# EAGLE design Freqy Lights 1v1 (EAGLE 7.3.0)
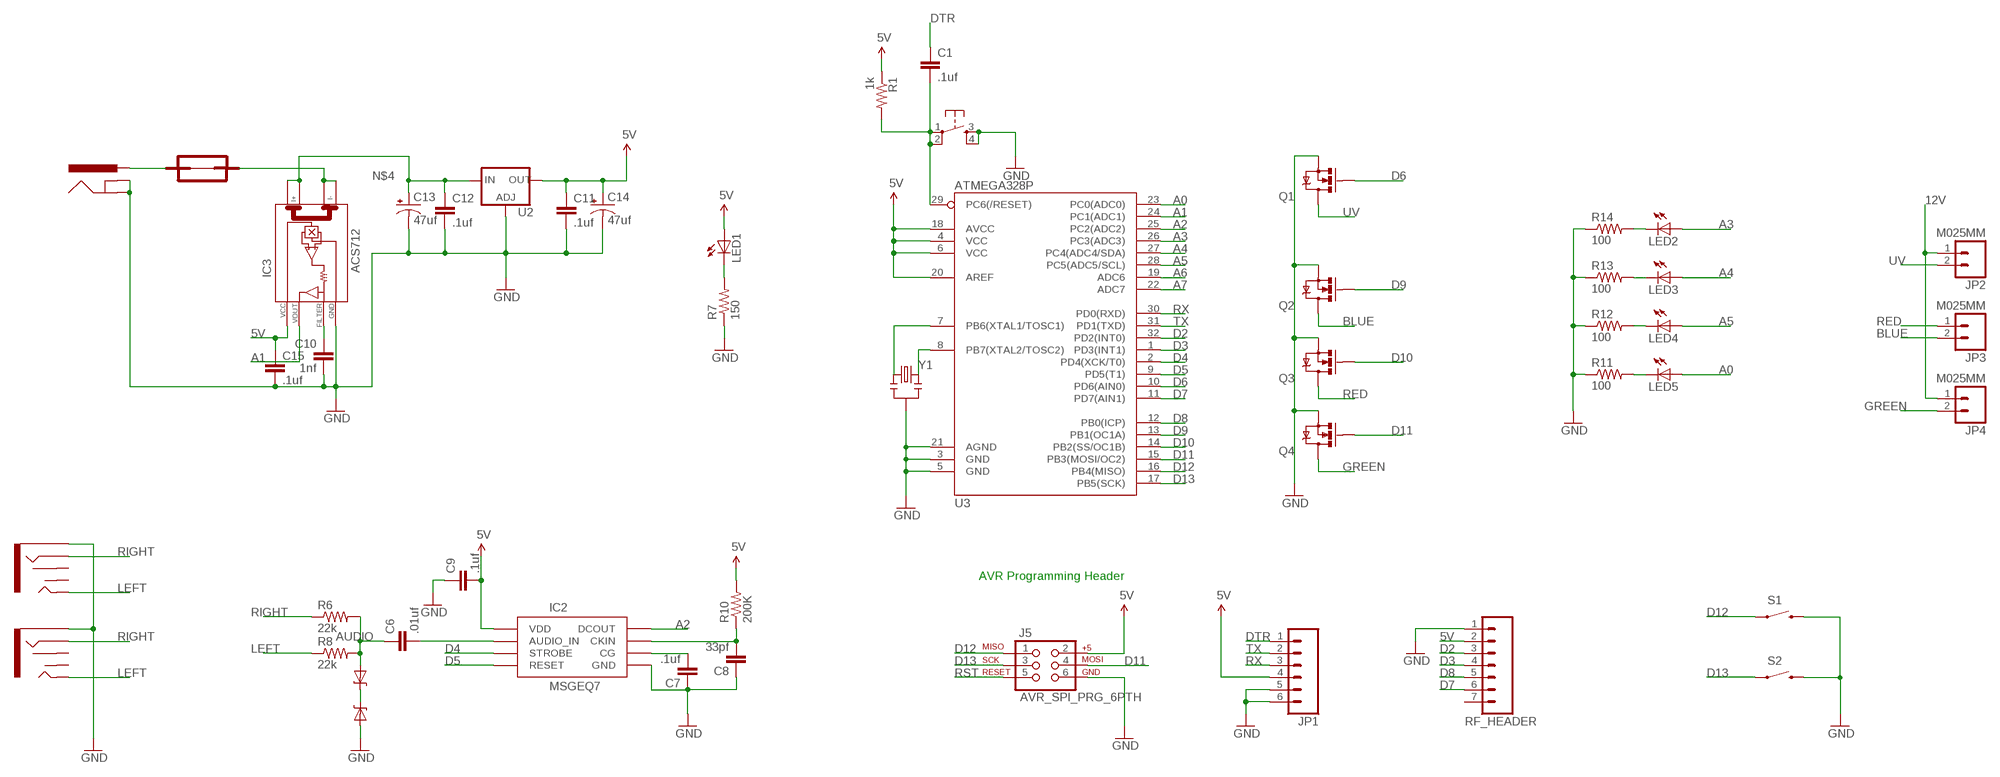
[diagram p0: schematic, sheet 1]

## Parts
AJ1  SC1488-1-ND_SMD_AUDIO_3.5  [3.5MM_SMD_AUDIO_SC1488-1-ND]
AJ2  SC1488-1-ND_SMD_AUDIO_3.5  [3.5MM_SMD_AUDIO_SC1488-1-ND]
BJ1  CP-202BH-ND_POWERJACK  [POWER_JACK_CP-202BH-ND]
C1  .1uf  CAP1206  [1206]
C6  .01uf  CAP1206  [1206]
C7  .1uf  CAP1206  [1206]
C8  33pf  CAP1206  [1206]
C9  .1uf  CAP1206  [1206]
C10  1nf  CAP1206  [1206]
C11  .1uf  CAP1206  [1206]
C12  .1uf  CAP1206  [1206]
C13  47uf  493-2202-1-ND_SMD_CAP  [SMD_47UF_CAP_493-2202-1-ND]
C14  47uf  493-2202-1-ND_SMD_CAP  [SMD_47UF_CAP_493-2202-1-ND]
C15  .1uf  CAP1206  [1206]
F1  SSQ12  [SSQ12]
IC2  MSGEQ7SOIC  [SOIC8]
IC3  ACS712  [SO08]
J5  AVR_SPI_PRG_6PTH  [2X3]
JP1  M06SIP  [1X06]
JP2  M025MM  [SCREWTERMINAL-5MM-2]
JP3  M025MM  [SCREWTERMINAL-5MM-2]
JP4  M025MM  [SCREWTERMINAL-5MM-2]
LED1  LED1206  [LED-1206]
LED2  LED1206  [LED-1206]
LED3  LED1206  [LED-1206]
LED4  LED1206  [LED-1206]
LED5  LED1206  [LED-1206]
P1  CKN9085CT-ND_SMT_PUSHBUTTON  [SMT_PUSHBUTTON_CKN9085CT-ND]
Q1  MOSFET-NCHANNELBSS138  [SOT23]
Q2  MOSFET-NCHANNELBSS138  [SOT23]
Q3  MOSFET-NCHANNELBSS138  [SOT23]
Q4  MOSFET-NCHANNELBSS138  [SOT23]
R1  1k  RESISTOR1206  [1206]
R6  22k  RESISTOR1206  [1206]
R7  150  RESISTOR1206  [1206]
R8  22k  RESISTOR1206  [1206]
R10  200K  RESISTOR1206  [1206]
R11  100  RESISTOR1206  [1206]
R12  100  RESISTOR1206  [1206]
R13  100  RESISTOR1206  [1206]
R14  100  RESISTOR1206  [1206]
RF_HEADER  M07  [1X07]
S1  SWITCH-MOMENTARY-2PTH  [TACTILE-PTH]
S2  SWITCH-MOMENTARY-2PTH  [TACTILE-PTH]
U2  V_REG_317SMD  [SOT223]
U3  ATMEGA328P  ATMEGA328_SMT  [TQFP32-08]
U$10  MM3Z3V3ST1GOSCT-ND_3V_DIODE  [3V_DIODE_MM3Z3V3ST1GOSCT-ND]
U$11  MM3Z3V3ST1GOSCT-ND_3V_DIODE  [3V_DIODE_MM3Z3V3ST1GOSCT-ND]
Y1  RESONATORPTH  [RESONATOR-PTH]

## Nets
5V: C9.2 C11.1 C14.P$2(+) C15.1 IC2.1(VDD) IC3.8(VCC) J5.2 JP1.4 LED1.A R1.1 R10.2 RF_HEADER.2 U2.2(OUT) U3.4(VCC) U3.6(VCC) U3.18(AVCC) U3.20(AREF)
12V: C12.1 C13.P$2(+) IC3.1(I+_0) IC3.2(I+_1) JP2.1 JP4.1 U2.3(IN)
A0: LED5.A U3.23(PC0(ADC0))
A1: IC3.7(VOUT) U3.24(PC1(ADC1))
A2: IC2.3(DCOUT) U3.25(PC2(ADC2))
A3: LED2.A U3.26(PC3(ADC3))
A4: LED3.A U3.27(PC4(ADC4/SDA))
A5: LED4.A U3.28(PC5(ADC5/SCL))
A6: U3.19(ADC6)
A7: U3.22(ADC7)
AUDIO: C6.1 R6.2 R8.2 U$11.P$2(A)
BLUE: JP3.2 Q2.3(D)
D2: RF_HEADER.3 U3.32(PD2(INT0))
D3: RF_HEADER.4 U3.1(PD3(INT1))
D4: IC2.4(STROBE) U3.2(PD4(XCK/T0))
D5: IC2.7(RESET) U3.9(PD5(T1))
D6: Q1.1(G) U3.10(PD6(AIN0))
D7: RF_HEADER.6 U3.11(PD7(AIN1))
D8: RF_HEADER.5 U3.12(PB0(ICP))
D9: Q2.1(G) U3.13(PB1(OC1A))
D10: Q3.1(G) U3.14(PB2(SS/OC1B))
D11: J5.4 Q4.1(G) U3.15(PB3(MOSI/OC2))
D12: J5.1 S1.1 U3.16(PB4(MISO))
D13: J5.3 S2.1 U3.17(PB5(SCK))
DTR: C1.1 JP1.1
GND: AJ1.RING AJ2.RING BJ1.GND BJ1.GNDBRK(GNDBREAK) C7.1 C8.1 C9.1 C10.2 C11.2 C12.2 C13.P$1(-) C14.P$1(-) C15.2 IC2.2(GND) IC3.5(GND) J5.6 JP1.5 JP1.6 P1.3 P1.4 Q1.2(S) Q2.2(S) Q3.2(S) Q4.2(S) R7.1 R11.1 R12.1 R13.1 R14.1 RF_HEADER.1 S1.3 S2.3 U2.1(ADJ) U3.3(GND) U3.5(GND) U3.21(AGND) U$10.P$2(A) Y1.2
GREEN: JP4.2 Q4.3(D)
LEFT: AJ1.TIP AJ2.TIP R8.1
N$3: U$10.P$1(C) U$11.P$1(C)
N$4: F1.P$2 IC3.3(I-_0) IC3.4(I-_1)
N$6: C7.2 IC2.6(CG)
N$9: C6.2 IC2.5(AUDIO_IN)
N$10: LED1.C R7.2
N$11: C8.2 IC2.8(CKIN) R10.1
N$13: U3.7(PB6(XTAL1/TOSC1)) Y1.1
N$14: U3.8(PB7(XTAL2/TOSC2)) Y1.3
N$15: C10.1 IC3.6(FILTER)
N$16: LED5.C R11.2
N$17: LED4.C R12.2
N$18: LED3.C R13.2
N$19: LED2.C R14.2
N$22: BJ1.PWR F1.P$1
RED: JP3.1 Q3.3(D)
RIGHT: AJ1.SLEEVE AJ2.SLEEVE R6.1
RST: C1.2 J5.5 P1.1 P1.2 R1.2 U3.29(PC6(/RESET))
RX: JP1.3 U3.30(PD0(RXD))
TX: JP1.2 U3.31(PD1(TXD))
UV: JP2.2 Q1.3(D)
Unconnected: AJ1.RSH AJ1.TSH AJ2.RSH AJ2.TSH RF_HEADER.7

## Notes on the sheet
- AVR Programming Header

## Library data of the parts
AJ1 AJ2 = SAUVE:SC1488-1-ND_SMD_AUDIO_3.5
BJ1 = SAUVE:CP-202BH-ND_POWERJACK
C1 C6-C12 C15 = SparkFun-Capacitors:CAP: Capacitor Standard 0603 ceramic capacitor, and 0.1" leaded capacitor.
C13 C14 = SAUVE:493-2202-1-ND_SMD_CAP
F1 = SAUVE:SSQ12
IC2 = SparkFun-AnalogIC:MSGEQ7: 7-band graphic equalizer
IC3 = ACS712:ACS712
J5 = SparkFun-Connectors:AVR_SPI_PRG_6: AVR ISP 6 Pin This is the reduced ISP connector for AVR programming. Common on Arduino. This footprint will take up less PCB space and can be used with a 10-pin to 6-pin adapter such as SKU: BOB-08508
JP1 = SparkFun-Connectors:M06: Header 6 Standard 6-pin 0.1" header. Use with straight break away headers (SKU : PRT-00116), right angle break away headers (PRT-00553), swiss pins (PRT-00743), machine pins (PRT-00117), and female headers (PRT-00115). Molex polarized connector foot print use with SKU : PRT-08094 with associated crimp pins and housings. NOTES ON THE VARIANTS LOCK and LOCK_LONGPADS... This footprint was designed to help hold the alignment of a through-hole component (i.e. 6-pin header) while soldering it into place. You may notice that each hole has been shifted either up or down by 0.005 of an inch from it's more standard position (which is a perfectly straight line). This slight alteration caused the pins (the squares in the middle) to touch the edges of the holes. Because they are alternating, it causes a "brace" to hold the component in place. 0.005 has proven to be the perfect amount of "off-center" position when using our standard breakaway headers. Although looks a little odd when you look at the bare footprint, once you have a header in there, the alteration is very hard to notice. Also,if you push a header all the way into place, it is covered up entirely on the bottom side. This idea of altering the position of holes to aid alignment will be further integrated into the Sparkfun Library for other footprints. It can help hold any component with 3 or more connection pins.
JP2-JP4 = SparkFun-Connectors:M02: Standard 2-pin 0.1" header. Use with - straight break away headers ( PRT-00116) - right angle break away headers (PRT-00553) - swiss pins (PRT-00743) - machine pins (PRT-00117) - female headers (PRT-00115) Molex polarized connector foot print use with: PRT-08233 with associated crimp pins and housings. 2.54_SCREWTERM for use with PRT-10571. 3.5mm Screw Terminal footprints for PRT-08084 5mm Screw Terminal footprints for use with PRT-08433
LED1-LED5 = SparkFun-LED:LED: LEDs Standard schematic elements and footprints for 5mm, 3mm, 1206, and 0603 sized LEDs. 5mm - Spark Fun Electronics SKU : COM-00529 (and others)
P1 = SAUVE:CKN9085CT-ND_SMT_PUSHBUTTON
Q1-Q4 = SparkFun-DiscreteSemi:MOSFET-NCHANNEL: Common NMOSFET Parts MFG P/N Store ID Prod ID FDD8780 TRANS-09984 SI7820DN TRANS-11055 FDS6630A IC-08089 2N7002PW TRANS-11151 FQP30N06L COM-10213 TRANS-10060 BSS123LT1G TRANS-08345 BSS138 TRANS-00830 BS170 2N7000; PROD_ID: TRANS-00830
R1 R6-R8 R10-R14 = SparkFun-Resistors:RESISTOR: Resistor Basic schematic elements and footprints for 0603, 1206, and PTH resistors.
RF_HEADER = SparkFun-Connectors:M07: Header 7 Standard 7-pin 0.1" header. Use with straight break away headers (SKU : PRT-00116), right angle break away headers (PRT-00553), swiss pins (PRT-00743), machine pins (PRT-00117), and female headers (PRT-00115). NOTES ON THE VARIANTS LOCK and LOCK_LONGPADS... This footprint was designed to help hold the alignment of a through-hole component (i.e. 7-pin header) while soldering it into place. You may notice that each hole has been shifted either up or down by 0.005 of an inch from it's more standard position (which is usually a perfectly straight line). This slight alteration caused the pins (the squares in the middle) to touch the edges of the holes. Because they are alternating, it causes a "brace" to hold the header in place. 0.005 has proven to be the perfect amount of "off-center" position when using our standard breakaway headers. Although looks a little odd when you look at the bare footprint, once you have a header in there, the alteration is very hard to notice. Also, if you push a header all the way into place, it is covered up entirely on the bottom side. This idea of altering the position of holes to aid alignment will be further integrated into the Sparkfun Library for other footprints. It can help hold any component with 3 or more connection pins.
S1 S2 = SparkFun-Electromechanical:SWITCH-MOMENTARY-2: Various NO switches- pushbuttons, reed, etc
U2 = SparkFun-PowerIC:V_REG_317: Voltage Regulator Standard LM317 adjustable voltage regulator. AOI (Adjust Output Input). Google 'LM317 Calculator' for easy to use app to get the two resistor values needed. 240/720 for 5V output. 240/390 for 3.3V output. Spark Fun Electronics SKU : COM-00527
U3 = SparkFun-DigitalIC:ATMEGA328_SMT: 32-Pin Atmega328 part Commonly used on Arduino compatible boards Available in QFP and QFN packages TQFP is IC-09069 QFN is non-stock; PROD_ID: IC-09069
U$10 U$11 = SAUVE:MM3Z3V3ST1GOSCT-ND_3V_DIODE
Y1 = SparkFun-FreqCtrl:RESONATOR: Resonator Small SMD resonator. Used, eg, on the Arduino Pro/ Pro Mini boards. 8MHz- XTAL-08895 16MHz- XTAL-08900

## Board
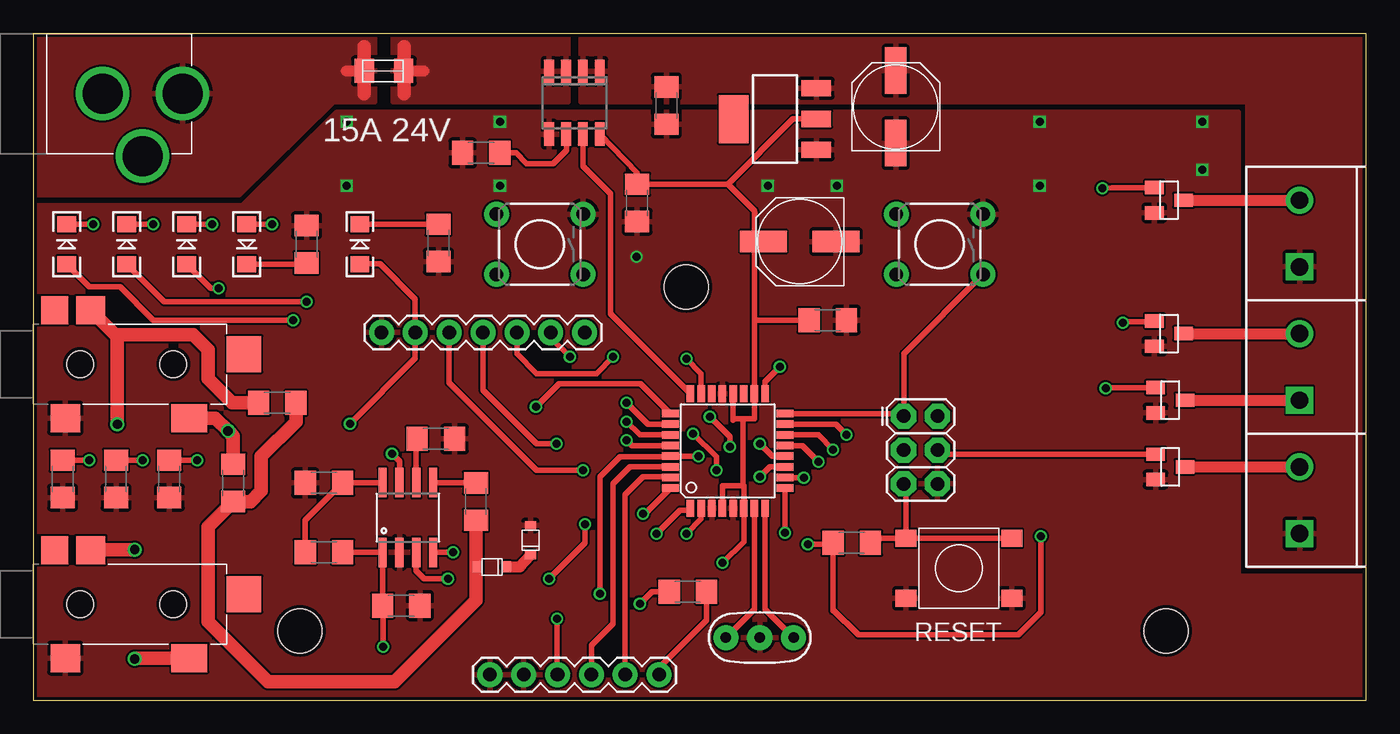
[diagram p1: board, top side]
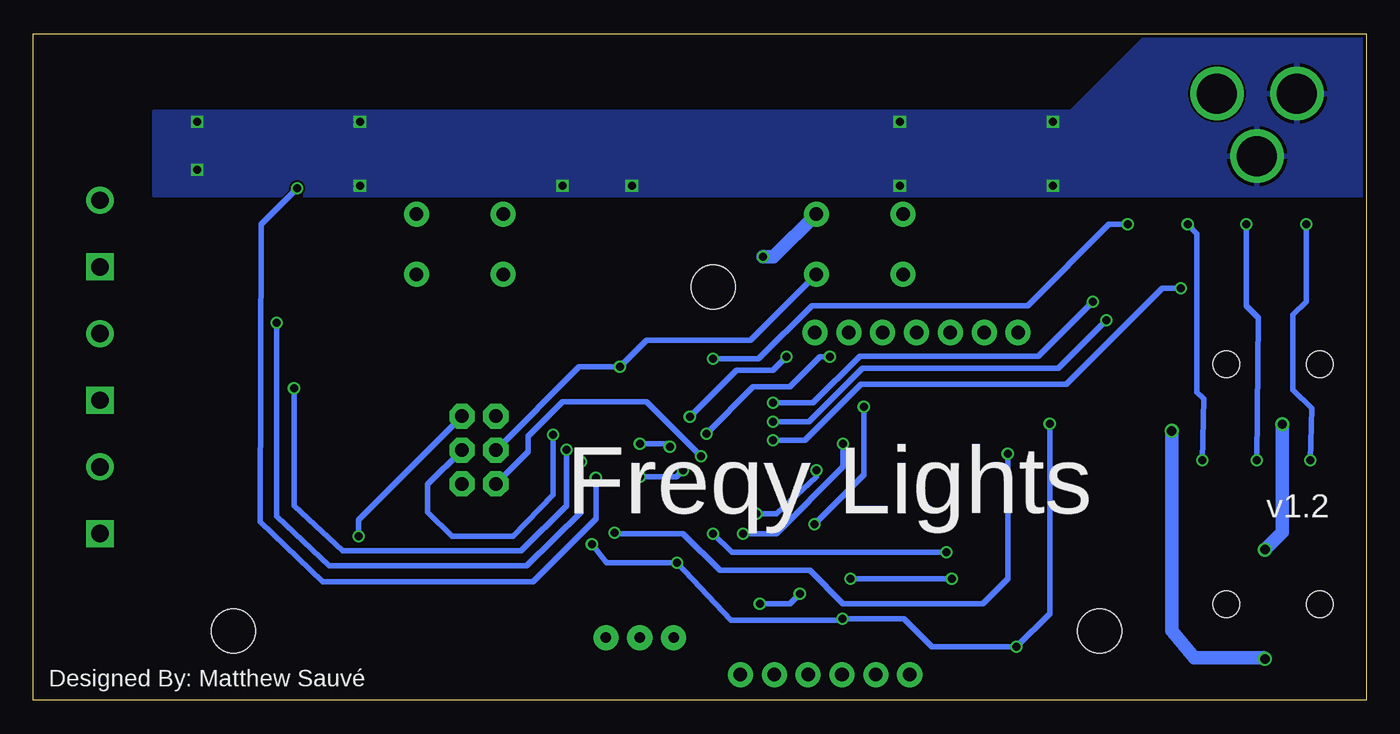
[diagram p2: board, bottom side, seen from below]

Size 100 x 50 mm. Coordinates in mm from the lower left corner, seen from the top.
Outline: 0,0 100,0 100,50 0,50 0,0
Copper layers (1*16): Top 0.035mm / dielectric 1.5mm / Bottom 0.035mm
Design rules "ITEADstudio_2-layer_DRC": minimum track width 6mil, minimum drill 12mil, track to track 6mil, track to pad 6mil, pad to pad 6mil, via to via 6mil, smd to smd 0mil, copper to edge 10mil, drill to drill 10mil, minimum pad ring 10mil, minimum via ring 6mil, stop-mask expansion 2mil, vias tented up to drill 100mil, thermal gap 10mil

### Footprints (pad centres in the part's own frame; a part is rotated, then mirrored left to right if it is on the bottom)
3.5MM_SMD_AUDIO_SC1488-1-ND = smd 2.2 x 2.1: RING 2.4,-4.05; SLEEVE 4.3,4.05 | smd 2 x 2.1: RSH 1.6,4.05 | smd 2.7 x 2.1: TIP 11.7,-4.05 | smd 2.6 x 2.7: TSH 15.8,0.75 | hole 2: 3.5,0; 10.5,0
POWER_JACK_CP-202BH-ND = drill 3: GND -3,0; GNDBRK 0,-4.7; PWR 3,0
1206 = smd 1.6 x 1.8: 1 -1.4,0; 2 1.4,0
SMD_47UF_CAP_493-2202-1-ND = smd 1.6 x 3.5: P$1 0,-2.72; P$2 0,2.72
SSQ12 = smd 1.45 x 1.8: P$1 -1.475,0; P$2 1.475,0
SOIC8 = smd 0.61 x 2.21: 1 -1.905,-2.616; 2 -0.635,-2.616; 3 0.635,-2.616; 4 1.905,-2.616; 5 1.905,2.616; 6 0.635,2.616; 7 -0.635,2.616; 8 -1.905,2.616
SO08 = smd 0.72 x 1.78: 1 -1.905,-2.35; 2 -0.635,-2.35; 3 0.635,-2.35; 4 1.905,-2.35; 5 1.905,2.35; 6 0.635,2.35; 7 -0.635,2.35; 8 -1.905,2.35
2X3 = drill 1.016 pad 1.88 octagon: 1 0,0; 2 0,2.54; 3 2.54,0; 4 2.54,2.54; 5 5.08,0; 6 5.08,2.54
1X06 = drill 1.016 pad 1.88: 1 0,0; 2 2.54,0; 3 5.08,0; 4 7.62,0; 5 10.16,0; 6 12.7,0
SCREWTERMINAL-5MM-2 = drill 1.3 pad 2.032 square: 1 0,0 | drill 1.3 pad 2.032: 2 5,0
LED-1206 = smd 1.2 x 1.4: A -1.5,0; C 1.5,0
SMT_PUSHBUTTON_CKN9085CT-ND = smd 1.55 x 1.3: 1 -3.975,2.25; 2 3.975,2.25; 3 -3.975,-2.25; 4 3.975,-2.25
SOT23 = smd 1 x 1.4: 1 -0.95,-1.1; 2 0.95,-1.1; 3 0,1.1
1X07 = drill 1.016 pad 1.88: 1 0,0; 2 2.54,0; 3 5.08,0; 4 7.62,0; 5 10.16,0; 6 12.7,0; 7 15.24,0
TACTILE-PTH = drill 1.016 pad 1.88: 1 -3.251,2.261; 2 3.251,2.261; 3 -3.251,-2.261; 4 3.251,-2.261
SOT223 = smd 1.219 x 2.235: 1 -2.311,-3.099; 2 0,-3.099; 3 2.311,-3.099 | smd 3.6 x 2.2: 4 0,3.099
TQFP32-08 = smd 1.27 x 0.559: 1 -4.293,2.8; 2 -4.293,2; 3 -4.293,1.2; 4 -4.293,0.4; 5 -4.293,-0.4; 6 -4.293,-1.2; 7 -4.293,-2; 8 -4.293,-2.8; 17 4.293,-2.8; 18 4.293,-2; 19 4.293,-1.2; 20 4.293,-0.4; 21 4.293,0.4; 22 4.293,1.2; 23 4.293,2; 24 4.293,2.8 | smd 0.559 x 1.27: 9 -2.8,-4.293; 10 -2,-4.293; 11 -1.2,-4.293; 12 -0.4,-4.293; 13 0.4,-4.293; 14 1.2,-4.293; 15 2,-4.293; 16 2.8,-4.293; 25 2.8,4.293; 26 2,4.293; 27 1.2,4.293; 28 0.4,4.293; 29 -0.4,4.293; 30 -1.2,4.293; 31 -2,4.293; 32 -2.8,4.293
STAND-OFF = hole 3.302: 0,0
3V_DIODE_MM3Z3V3ST1GOSCT-ND = smd 0.63 x 0.83: P$1 -1.115,0; P$2 1.115,0
RESONATOR-PTH = drill 0.8 pad 1.88: 1 -2.54,0; 2 0,0; 3 2.54,0

### Placement (x,y rotation side)
AJ1  0,25.2 0 top
AJ2  0,7.2 0 top
BJ1  8.19,45.5 0 top
C1  49.1,8.15 180 top
C6  33.2,14.9 90 top
C7  30.2,19.6 180 top
C8  21.8,16.3 0 top
C9  27.6,7.1 180 top
C10  33.6,41.05 180 top
C11  59.6,28.5 0 top
C12  47.5,44.6 270 top
C13  64.7,44.5 0 top
C14  57.5,34.4 90 top
C15  45.3,37.3 270 top
F1  26.3,47.2 0 top
IC2  28.1,13.7 0 top
IC3  40.6,44.81 180 top
J5  65.3,21.3 270 top
JP1  46.95,1.92 180 top
JP2  95,32.5 90 top
JP3  95,22.5 90 top
JP4  95,12.5 90 top
LED1  24.5,34.2 90 top
LED2  7,34.2 90 top
LED3  2.5,34.2 90 top
LED4  11.5,34.2 90 top
LED5  16,34.2 270 top
P1  69.44,9.9 0 top
Q1  85.2,37.5 270 top
Q2  85.2,27.5 270 top
Q3  85.3,22.5 270 top
Q4  85.3,17.5 270 top
R1  61.4,11.8 0 top
R6  18.3,22.3 0 top
R7  30.4,34.3 90 top
R8  15,16.3 270 top
R10  21.8,11.1 0 top
R11  20.5,34.2 270 top
R12  10.2,16.6 90 top
R13  2.2,16.6 90 top
R14  6.2,16.6 90 top
RF_HEADER  26.12,27.58 0 top
S1  68,34.2 180 top
S2  38,34.2 180 top
U2  55.64,43.59 90 top
U3  52.1,18.7 90 top
U$1  [STAND-OFF]  49,31 0 top
U$2  [STAND-OFF]  20,5.2 0 top
U$3  [STAND-OFF]  85,5.2 0 top
U$10  37.3,12 90 top
U$11  34.4,10 180 top
Y1  54.5,4.7 0 top

### Tracks (layer width: path | path; a pad name or v marks a point on that pad's centre or on a via)
5V  (via drill 0.6)
  Top 0.406: R10.2 26.18,11.1 IC2.1 C9.2 26.25,7.05 v26.25,4 | U3.4 51.7,16.1 53.25,16.1 | 52.5,21 U3.20 52.5,21.1 53.25,21.1 | 53.25,21.1 54.1,21.1 U3.18 54.1,28.5 | 53.25,16.1 53.3,16.1 U3.6 53.3,11.9 v51.7,10.3 | IC3.8 45.3,39.56 C15.1 52.1,38.7 | 52.1,38.7 57,43.6 58.73,43.6 U2.2 | v58.1,11.7 59.7,11.7 R1.1 60,6.8 | 52.1,38.7 54.1,36.7 54.1,36.6 | v75.6,12.3 75.6,6.6 73.9,4.9 61.9,4.9 60,6.8 | 60,6.7 60,6.8 | 54.13,36.57 54.1,36.6 | C11.1 54.1,28.5 | 54.1,28.5 54.1,34.2 | 54.1,34.2 54.1,36.6 | C14.P$2 54.4,34.5 54.1,34.2 | LED1.A 24.55,32.75 26,32.75 28.66,30.09 RF_HEADER.2 28.66,25.66 v23.75,20.75 | 53.25,16.1 53.25,21.1 | v39.3,6.1 39.3,1.95 JP1.4
  Bottom 0.406: v58.1,11.7 57,10.3 v51.7,10.3 47.65,6 39.2,6 v39.3,6.1 34.7,6.1 32.6,4 v26.25,4 23.75,6.5 v23.75,20.75 | J5.2 75.6,13.54 v75.6,12.3
12V
  pour Top: 41.1,50 100,50 100,10.1 91.1,10.1 91.1,44.9 41.1,44.9
A0  (via drill 0.6)
  Top 0.406: U3.23 50.1,24.5 v49,25.6 | LED5.A v17.9,35.7
  Bottom 0.406: v17.9,35.7 19.3,35.7 25.4,29.6 41.6,29.6 45.6,25.6 v49,25.6
A1
  Top 0.406: IC3.7 41.23,40.06 43.3,38 43.3,28.99 U3.24
A2  (via drill 0.6)
  Top 0.406: v31.1,9.1 29.3,9.1 28.7,9.7 28.7,11.05 IC2.3 | v37.7,22 39.45,23.75 45.56,23.75 U3.25 | v38.7,9.1 41.4,11.8 v41.4,13.2
  Bottom 0.406: v37.7,22 37.7,16.9 v41.4,13.2 | v38.7,9.1 v31.1,9.1
A3  (via drill 0.6)
  Top 0.406: U3.26 46.1,20.7 v44.5,22.3 | LED2.A 9.8,29.9 v20.5,29.9
  Bottom 0.406: v44.5,22.3 41.5,22.3 38,25.8 24.6,25.8 v20.5,29.9
A4  (via drill 0.6)
  Top 0.406: v44.5,20.9 45.5,19.9 U3.27 | LED3.A 4.2,31 6.5,31 9,28.5 v19.5,28.5
  Bottom 0.406: v19.5,28.5 23.1,24.9 37.8,24.9 41.8,20.9 v44.5,20.9
A5  (via drill 0.6)
  Top 0.406: v44.5,19.5 44.9,19.1 U3.28 | LED4.A 13.3,30.9 v13.9,30.9
  Bottom 0.406: v13.9,30.9 15.3,30.9 22.5,23.7 37.9,23.7 42.1,19.5 v44.5,19.5
AUDIO
  Top 0.406: U$11.P$2 33.19,9.91 33.2,9.9
  Top 1.016: C6.1 33.2,9.9 33.2,7.5 27.1,1.4 17.6,1.4 13.1,5.9 13.1,13 R8.2 | 14.88,14.79 R8.2 | R8.2 16.3,14.9 17.1,15.7 17.1,18.3 19.7,20.9 R6.2
BLUE
  Top 0.813: Q2.3 JP3.2
D2  (via drill 0.6)
  Top 0.406: RF_HEADER.3 31.2,23.8 37.75,17.25 v41.25,17.25 | 47.71,16 U3.32 45.91,14 v45.75,14
  Bottom 0.406: v41.25,17.25 41.25,16.75 44.25,14 v45.75,14
D3  (via drill 0.6)
  Top 0.406: RF_HEADER.4 33.74,23.26 37.75,19.25 v39.25,19.25 | v46.75,12.5 48.5,14.25 49.14,14.25 U3.1
  Bottom 0.406: v39.25,19.25 39.25,17.5 44.25,12.5 v46.75,12.5
D4  (via drill 0.6)
  Top 0.406: IC2.4 30.02,11.1 v31.5,11.1 | U3.2 50.1,13.6 v49,12.5
  Bottom 0.406: v31.5,11.1 47.6,11.1 v49,12.5
D5  (via drill 0.6)
  Top 0.406: IC2.7 27.46,17.93 v26.9,18.5 | U3.9 v56.4,12.55
  Bottom 0.406: v26.9,18.5 26.9,9.1 28.75,7.25 39.25,7.25 41.75,9.75 48.5,9.75 51.25,12.5 56.35,12.5 v56.4,12.55
D6  (via drill 0.6)
  Top 0.406: U3.10 v57.8,16.7 | Q1.1 80.95,38.45 v80.2,38.4
  Bottom 0.406: v80.2,38.4 82.9,35.7 83,13.4 78.3,8.9 62.5,8.9 57.8,13.6 v57.8,16.7
D7  (via drill 0.6)
  Top 0.406: RF_HEADER.6 38.82,27.18 v40.25,25.75 | v49.5,20 51.25,18.25 v51.25,17.25 | v54.5,16.75 55.25,17.5 U3.11
  Bottom 0.406: v40.25,25.75 41,25.75 43.25,23.5 46,23.5 v49.5,20 | v51.25,17.25 51.75,16.75 v54.5,16.75
D8  (via drill 0.6)
  Top 0.406: RF_HEADER.5 36.28,25.97 37.75,24.5 42.25,24.5 v43.5,25.75 | v50.75,21.25 52.25,19.75 v52.25,19 | v54.5,19.25 55.45,18.3 U3.12
  Bottom 0.406: v43.5,25.75 44.5,24.75 47.25,24.75 v50.75,21.25 | v52.25,19 52.5,19.25 v54.5,19.25
D9  (via drill 0.6)
  Top 0.406: U3.13 57.7,19.1 v58.9,17.9 | Q2.1 84.05,28.4 81.85,28.4 v81.75,28.3
  Bottom 0.406: v58.9,17.9 58.9,14.1 63,10.1 77.8,10.1 81.75,13.8 v81.75,28.3
D10  (via drill 0.6)
  Top 0.406: U3.14 58.9,19.9 v60,18.8 | Q3.1 80.5,23.45 v80.45,23.4
  Bottom 0.406: v60,18.8 60,14.6 63.4,11.2 76.8,11.2 80.45,14.6 v80.45,23.4
D11  (via drill 0.6)
  Top 0.406: U3.15 60.2,20.7 v61,19.9 | Q4.1 68.15,18.45 J5.4
  Bottom 0.406: v61,19.9 61,15.4 64,12.3 68.6,12.3 70.4,14.1 70.4,16.2 J5.4
D12
  Top 0.406: U3.16 65.1,21.5 J5.1 65.3,25.99 S1.1
D13  (via drill 0.6)
  Top 0.406: v56,25 54.9,23.9 U3.17
  Bottom 0.406: J5.3 59.06,25 v56,25 54,27 46.19,27 S2.1
DTR
  Top 0.406: C1.1 50.5,6 46.9,2.4 46.9,1.97 JP1.1
GND  (via drill 0.6)
  Bottom 1.016: S2.3 44.46,33.25 v45.25,33.25
  other vias: 23.5,38.6 23.5,43.4 55.1,38.6 60.3,38.6 87.7,43.4 87.7,39.8 75.5,38.6 75.5,43.4 35,38.6 35,43.4
  pour Top: 0,37.1 15.7,37.1 22.8,44.1 90.4,44.1 90.4,9.3 100,9.3 100,0 0,0
  pour Bottom: 0,50 0,37.9 90.9,37.9 90.9,44.1 22.1,44.1 16.2,50
GREEN
  Top 0.813: Q4.3 JP4.2
LEFT  (via drill 0.7)
  Top 1.016: AJ2.TIP 7.65,3.15 v7.6,3.1 | R8.1 15,19.8 v14.6,20.2 13.65,21.15 AJ1.TIP
  Bottom 1.016: v14.6,20.2 14.6,5.2 12.9,3.2 7.7,3.2 v7.6,3.1
N$3
  Top 0.813: U$11.P$1 36.52,10 U$10.P$1
N$4
  Top 0.813: 27.4,47.2 29.3,47.2
  Top 1.016: 27.8,49 27.8,45.5
  pour Top: 27,50 40.1,50 40.1,44.9 27,44.9
N$6
  Top 0.406: IC2.6 28.73,19.54 C7.2
N$9
  Top 0.406: C6.2 30.02,16.3 IC2.5
N$10
  Top 0.406: LED1.C R7.2
N$11
  Top 0.406: R10.1 20.4,13.5 C8.2 26.18,16.3 IC2.8
N$13
  Top 0.406: Y1.1 54.1,6.84 U3.7
N$14
  Top 0.406: Y1.3 54.9,6.84 U3.8
N$15
  Top 0.406: C10.1 36.2,41.05 37,40.25 39,40.25 40,41.25 40,42.42 IC3.6
N$16
  Top 0.406: LED5.C 20.4,32.7 R11.2
N$17  (via drill 0.6)
  Top 0.406: R12.2 v12.3,18 | LED4.C v13.4,35.7
  Bottom 0.406: v12.3,18 12.2,22.6 12.7,23.1 12.7,35 v13.4,35.7
N$18  (via drill 0.6)
  Top 0.406: v4.2,18 R13.2 | LED3.C v4.5,35.7
  Bottom 0.406: v4.2,18 4.1,21.9 5.5,23.3 5.5,28.9 4.5,29.9 v4.5,35.7
N$19  (via drill 0.6)
  Top 0.406: R14.2 v8.2,18 | LED2.C v9,35.7
  Bottom 0.406: v8.2,18 8.1,28.7 9,29.6 v9,35.7
N$22
  Top 0.813: 23.5,47.2 25.1,47.2
  Top 1.016: 24.8,49 24.8,45.5
  pour Top: 0,50 0,37.9 15.4,37.9 22.5,44.9 25.6,44.9 25.6,50
RED
  Top 0.813: Q3.3 JP3.1
RIGHT  (via drill 0.7)
  Top 1.016: AJ2.SLEEVE 4.35,11.3 v7.6,11.3 | AJ1.SLEEVE 6.3,27.25 v6.3,20.7 6.3,27.4 12,27.4 13.1,26.3 13.1,24.1 14.9,22.3 R6.1
  Bottom 1.016: v7.6,11.3 6.3,12.6 v6.3,20.7
RST  (via drill 0.6)
  Top 0.406: 62.33,12.12 R1.2 63.15,12.15 P1.1 | v49.9,18.3 U3.29 47.76,18.25 44,18.25 42.5,16.75 v42.5,8 | P1.1 P1.2 | J5.5 65.47,16.05 P1.1 | C1.2 46.4,8.15 v45.5,7.25
  Bottom 0.406: v49.9,18.3 54,22.4 60.3,22.4 62.9,19.8 62.9,18.62 J5.5 | v45.5,7.25 43.25,7.25 v42.5,8
RX
  Top 0.406: JP1.3 41.87,4.12 43.5,5.75 43.5,16.25 44.75,17.5 U3.30
TX
  Top 0.406: JP1.2 44.41,15.41 45.75,16.75 47.76,16.75 U3.31
UV
  Top 0.813: Q1.3 JP2.2

### Text on the board
tPlace: 15A 24V | RESET
bPlace: v1.2 | Freqy Lights | Designed By: Matthew Sauvé
tSilk: Designed By: Matthew Sauvé | Designed By: Matthew Sauvé